# EAGLE schematic rom (EAGLE 9.0.0)

## Sheet 1 of 2
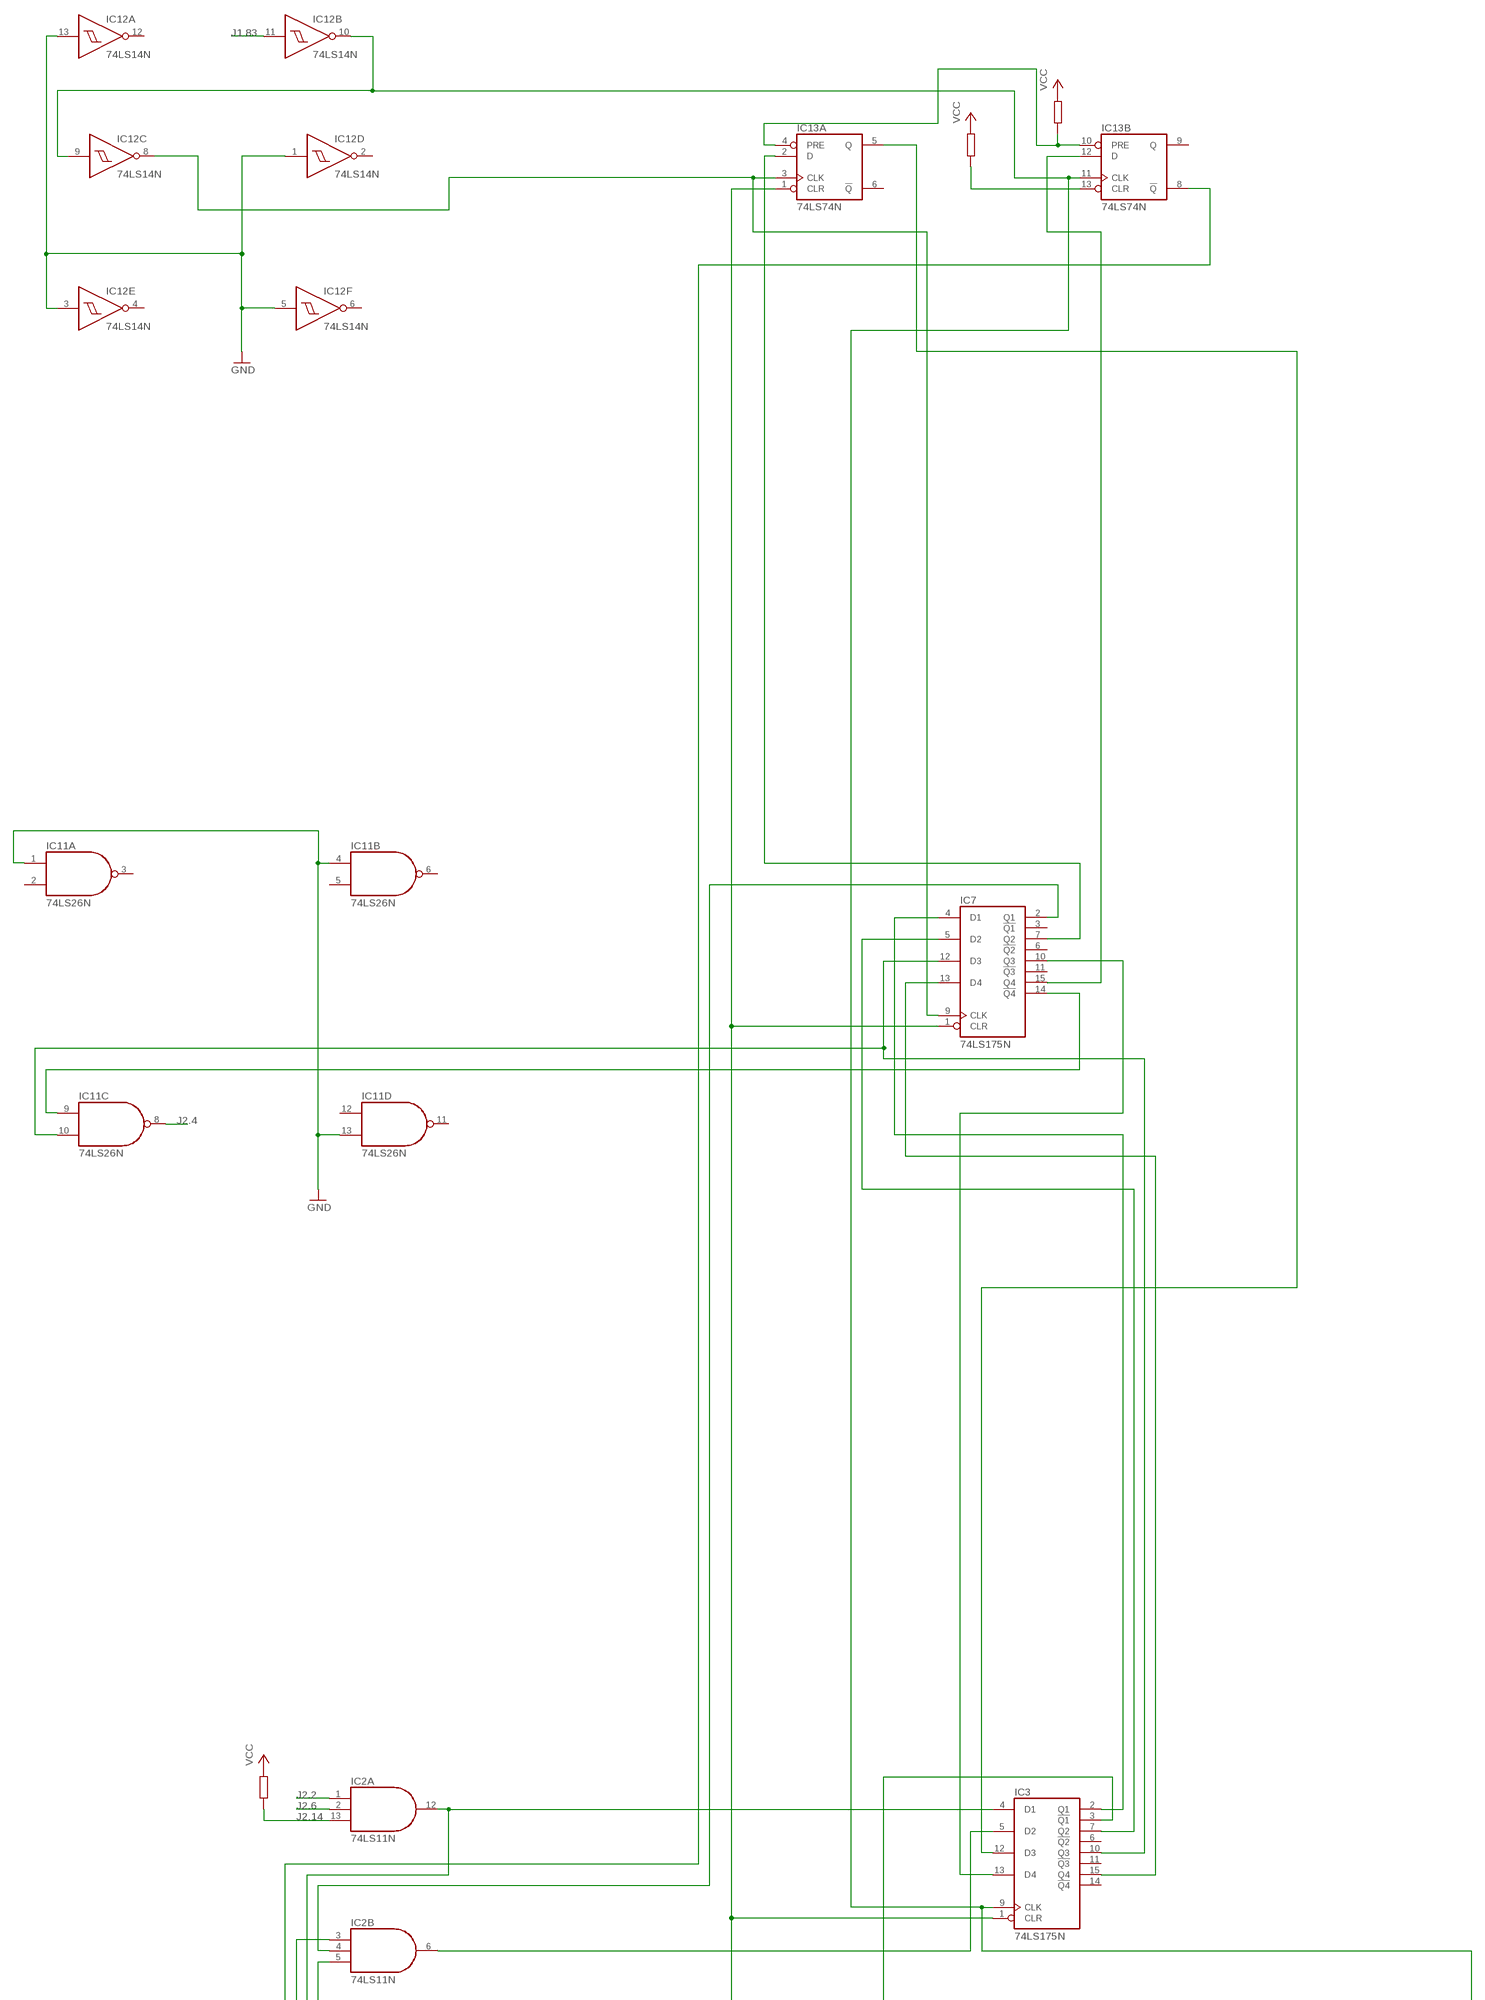
[diagram p0: schematic, sheet 1, part 1 of 3]
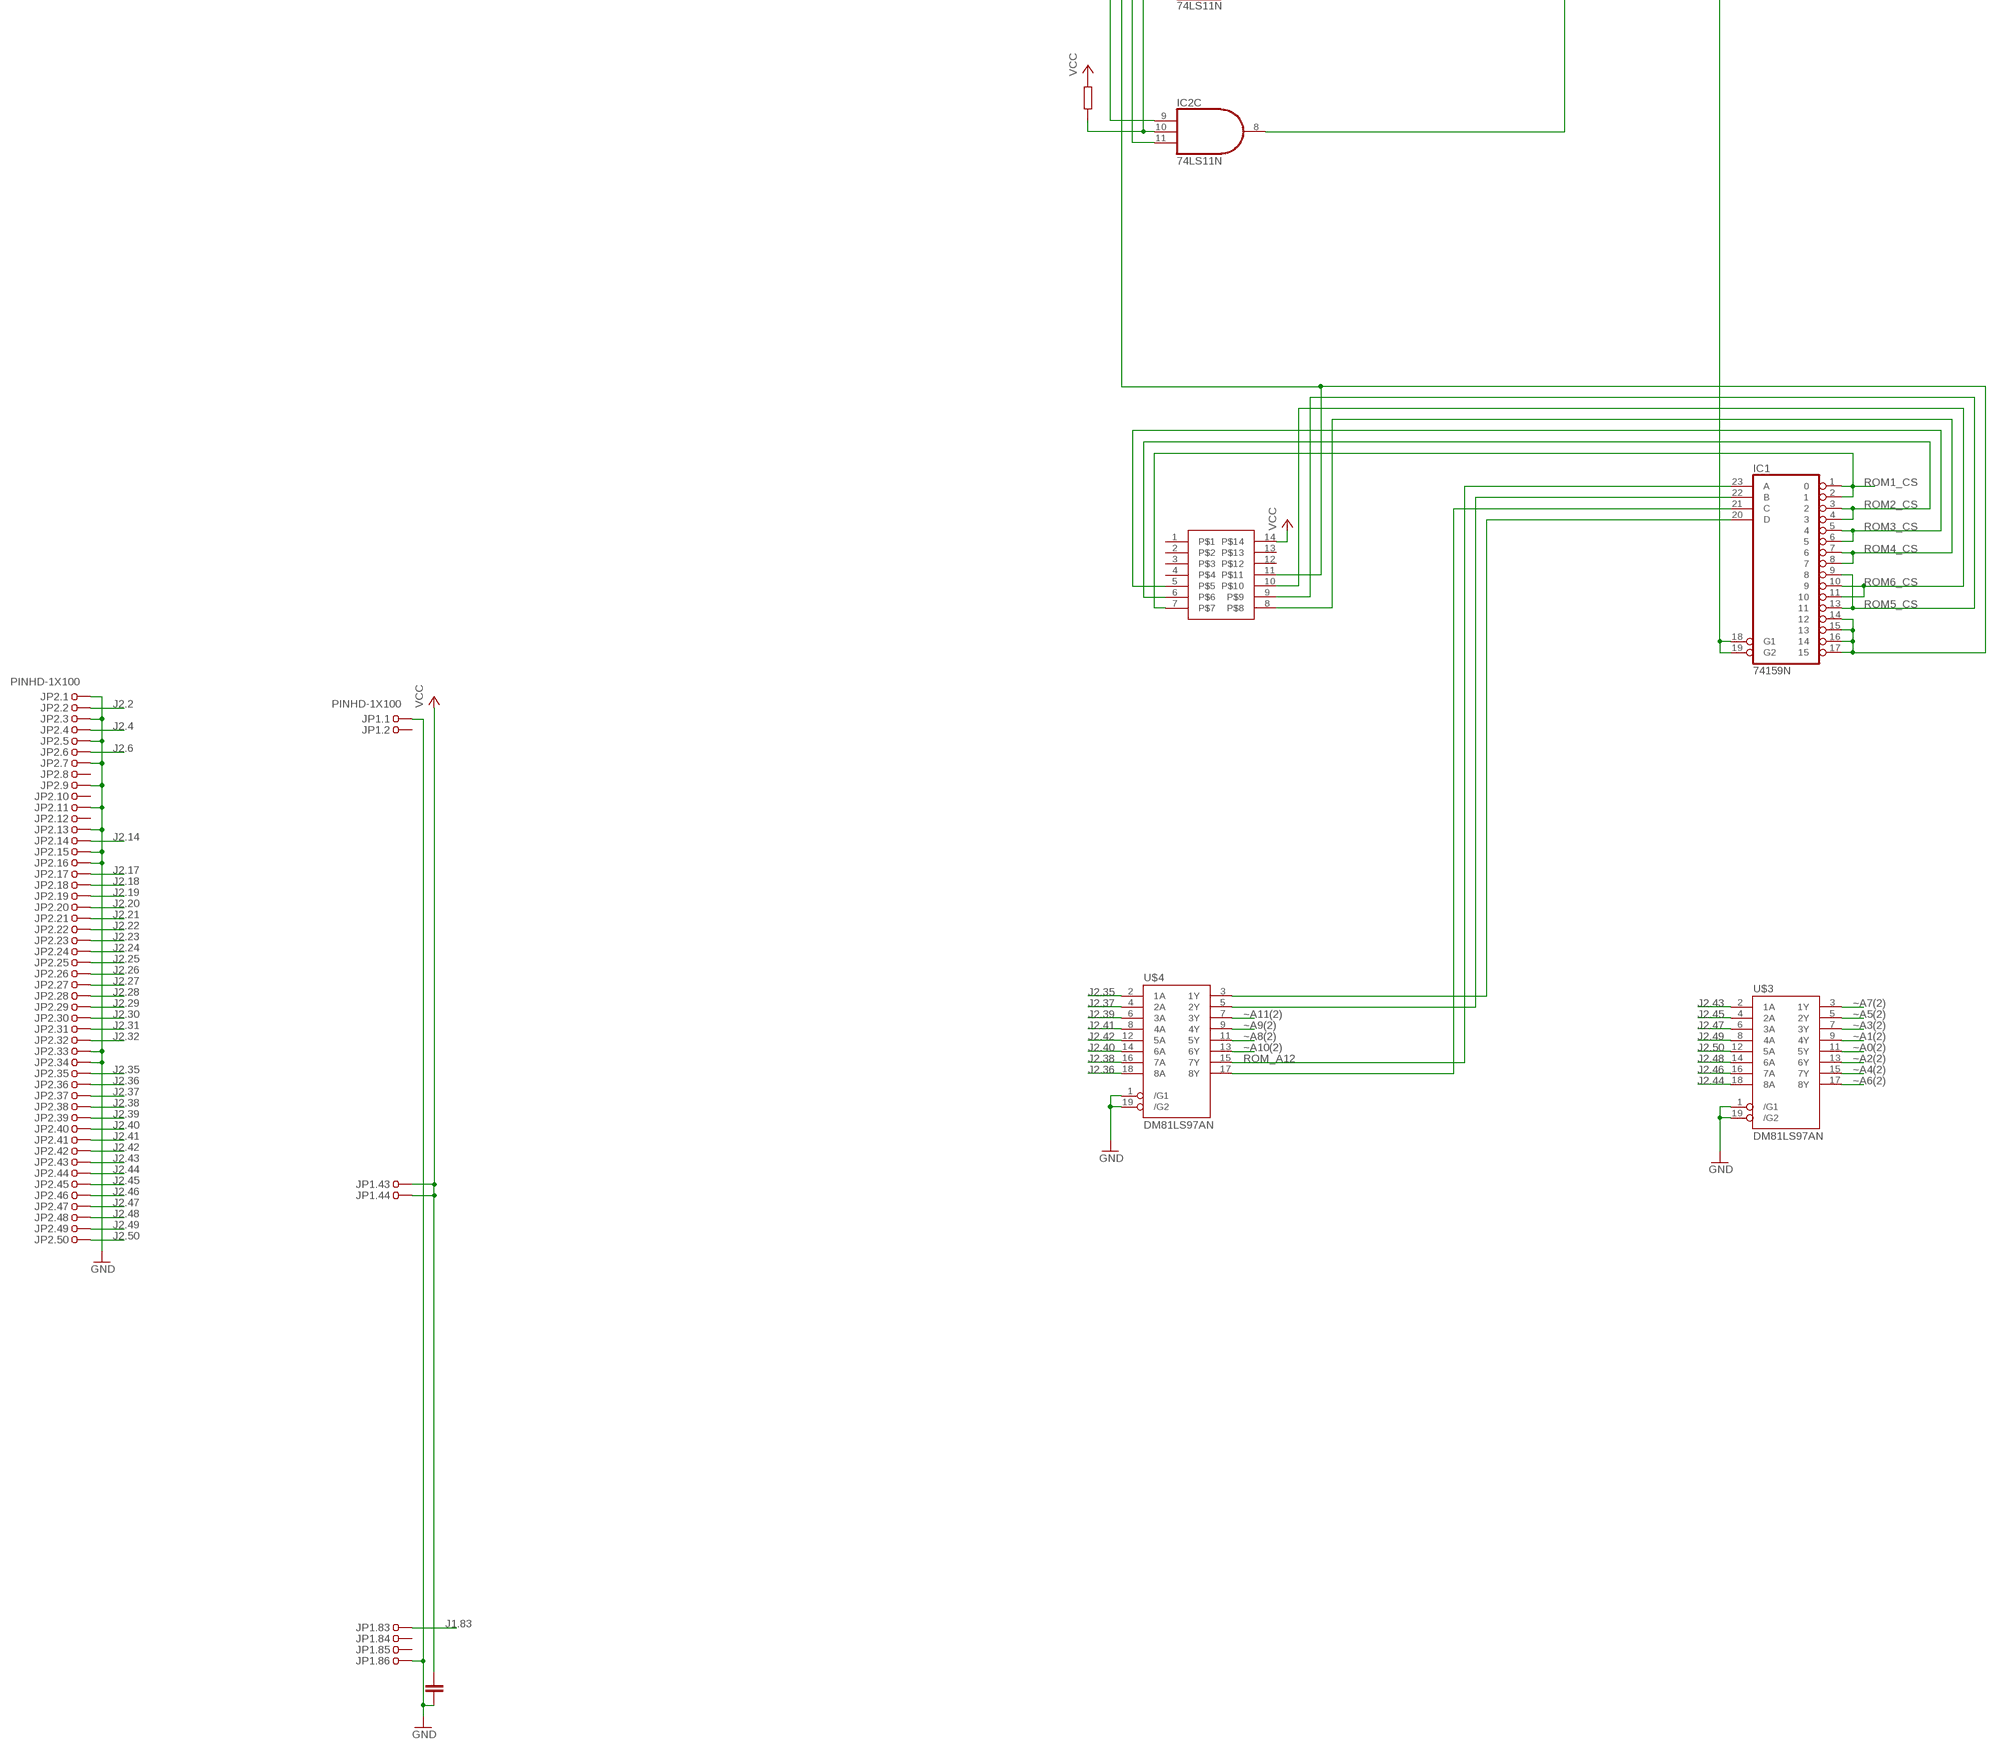
[diagram p1: schematic, sheet 1, part 2 of 3]
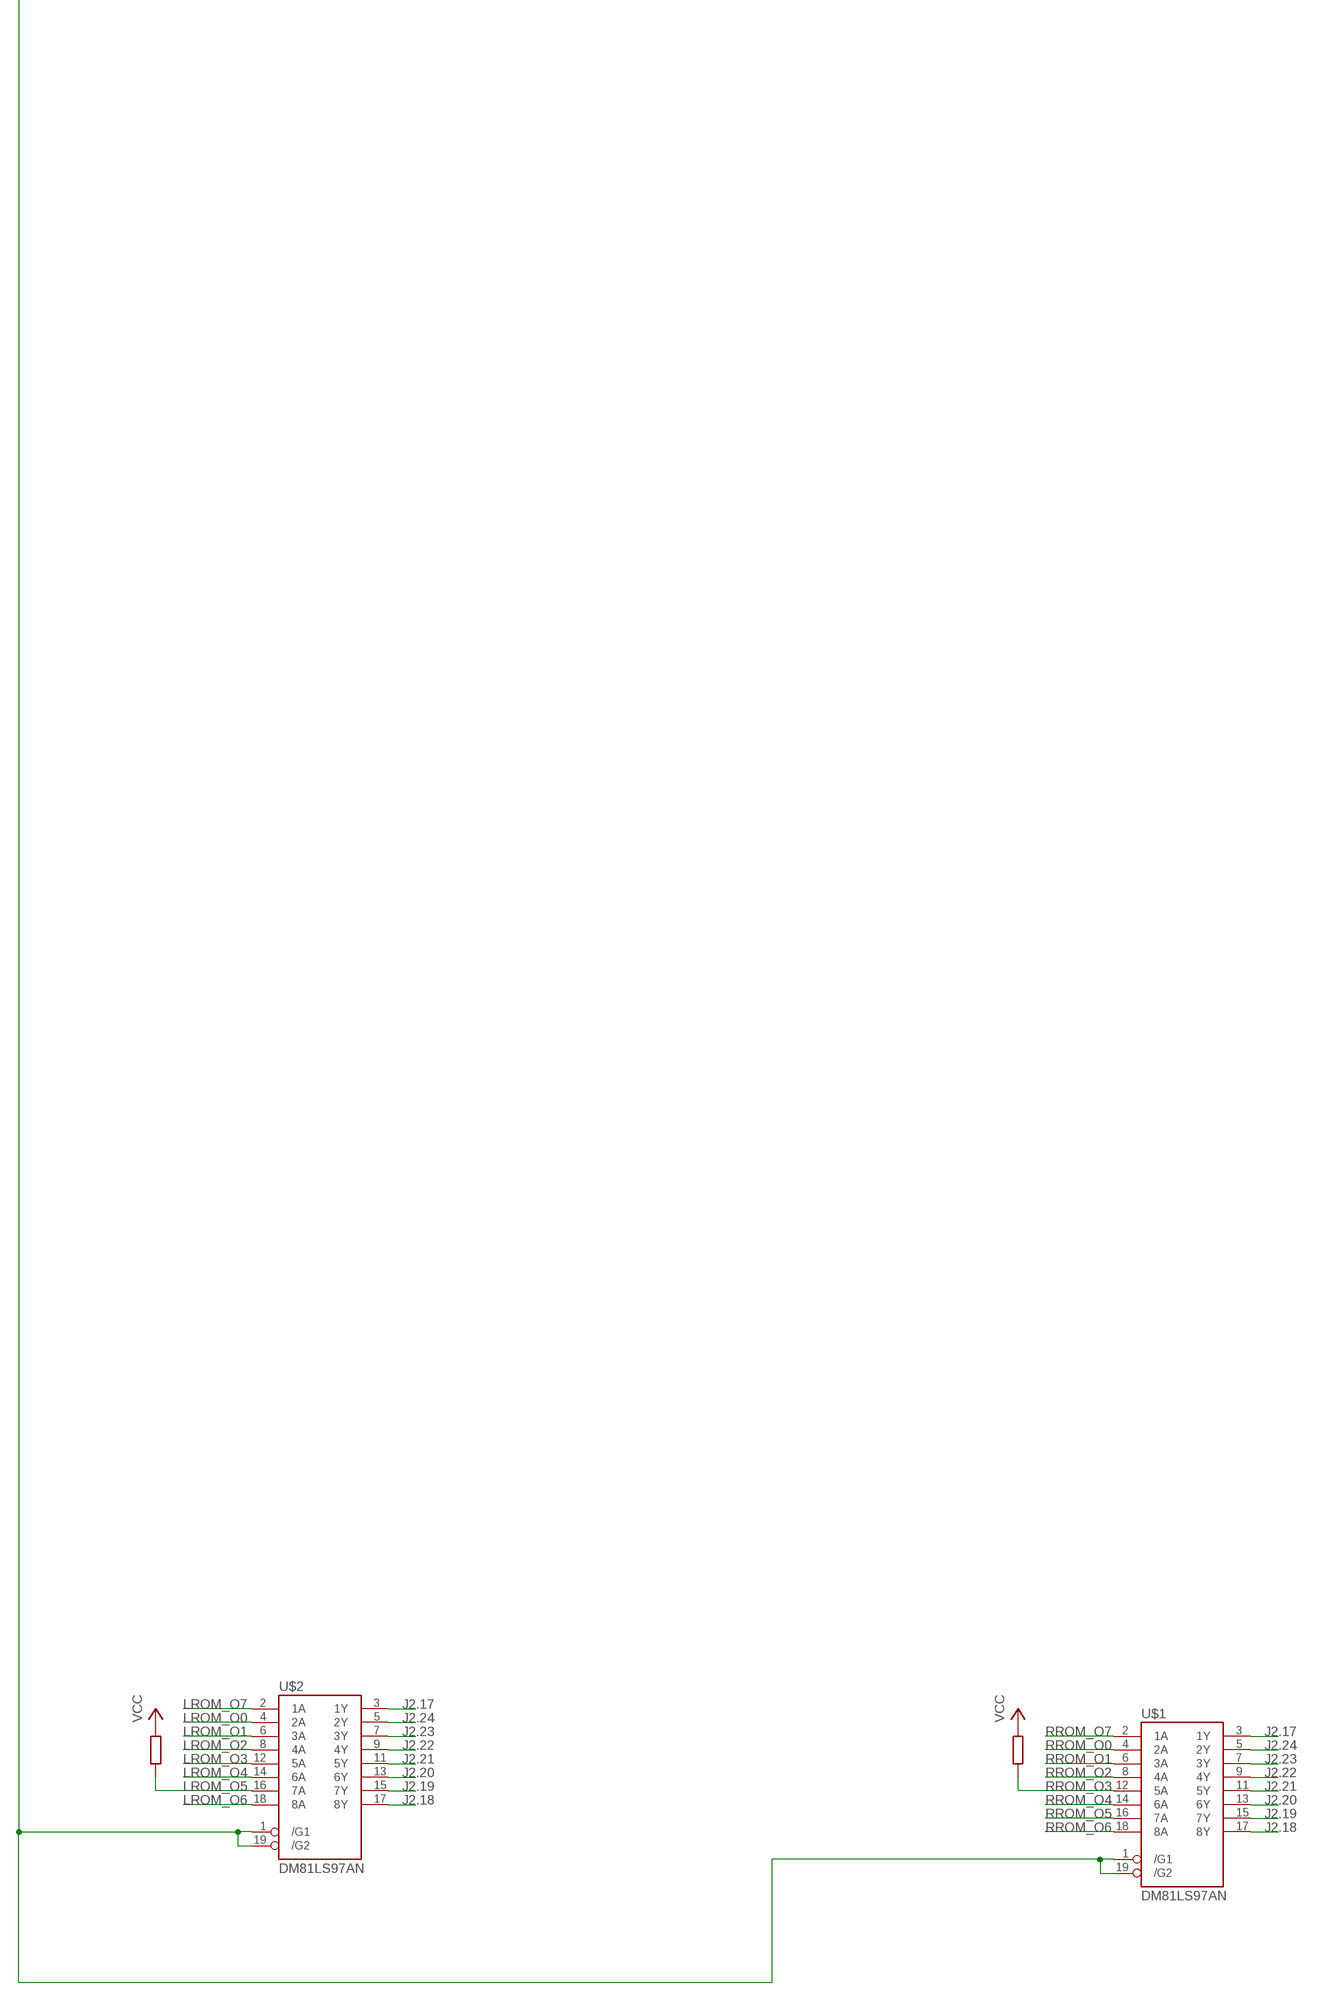
[diagram p2: schematic, sheet 1, part 3 of 3]

### Parts
IC1  74159N  [DIL24-6]
IC2  74LS11N  [DIL14]
IC3  74LS175N  [DIL16]
IC7  74LS175N  [DIL16]
IC11  74LS26N  [DIL14]
IC12  74LS14N  [DIL14]
IC13  74LS74N  [DIL14]
JP1  PINHD-1X100  [1X100]
JP2  PINHD-1X100  [1X100]
U$1  DM81LS97AN  [DIL20]
U$2  DM81LS97AN  [DIL20]
U$3  DM81LS97AN  [DIL20]
U$4  DM81LS97AN  [DIL20]
U$5  1810-0083  [DIL14]

### Nets
GND: IC11.1(A:I0) IC11.4(B:I0) IC11.13(D:I1) IC12.1(D:I) IC12.3(E:I) IC12.5(F:I) IC12.13(A:I) JP1.1 JP1.86 JP2.1 JP2.3 JP2.5 JP2.7 JP2.9 JP2.11 JP2.13 JP2.15 JP2.16 JP2.33 JP2.34 U$3.1(/G1) U$3.19(/G2) U$4.1(/G1) U$4.19(/G2) ; also sheet 2
J1.83: IC12.11(B:I) JP1.83
J2.2: IC2.1(A:I0) JP2.2
J2.4: JP2.4
J2.6: IC2.2(A:I1) JP2.6
J2.14: IC2.13(A:I2) JP2.14 ; also sheet 2
J2.17: JP2.17 U$1.3(1Y) U$2.3(1Y)
J2.18: JP2.18 U$1.17(8Y) U$2.17(8Y)
J2.19: JP2.19 U$1.15(7Y) U$2.15(7Y)
J2.20: JP2.20 U$1.13(6Y) U$2.13(6Y)
J2.21: JP2.21 U$1.11(5Y) U$2.11(5Y)
J2.22: JP2.22 U$1.9(4Y) U$2.9(4Y)
J2.23: JP2.23 U$1.7(3Y) U$2.7(3Y)
J2.24: JP2.24 U$1.5(2Y) U$2.5(2Y)
J2.25: JP2.25
J2.26: JP2.26
J2.27: JP2.27
J2.28: JP2.28
J2.29: JP2.29
J2.30: JP2.30
J2.31: JP2.31
J2.32: JP2.32
J2.35: JP2.35 U$4.2(1A)
J2.36: JP2.36 U$4.18(8A)
J2.37: JP2.37 U$4.4(2A)
J2.38: JP2.38 U$4.16(7A)
J2.39: JP2.39 U$4.6(3A)
J2.40: JP2.40 U$4.14(6A)
J2.41: JP2.41 U$4.8(4A)
J2.42: JP2.42 U$4.12(5A)
J2.43: JP2.43 U$3.2(1A)
J2.44: JP2.44 U$3.18(8A)
J2.45: JP2.45 U$3.4(2A)
J2.46: JP2.46 U$3.16(7A)
J2.47: JP2.47 U$3.6(3A)
J2.48: JP2.48 U$3.14(6A)
J2.49: JP2.49 U$3.8(4A)
J2.50: JP2.50 U$3.12(5A)
LROM_O0: U$2.4(2A) ; also sheet 2
LROM_O1: U$2.6(3A) ; also sheet 2
LROM_O2: U$2.8(4A) ; also sheet 2
LROM_O3: U$2.12(5A) ; also sheet 2
LROM_O4: U$2.14(6A) ; also sheet 2
LROM_O5: U$2.16(7A) ; also sheet 2
LROM_O6: U$2.18(8A) ; also sheet 2
LROM_O7: U$2.2(1A) ; also sheet 2
N$1: IC1.20(D) U$4.3(1Y)
N$2: IC1.22(B) U$4.5(2Y)
N$3: IC7.7(Q2) IC13.2(A:D)
N$4: IC2.8(C:O) IC3.1(CLR) IC7.1(CLR) IC13.1(A:CLR)
N$5: IC2.4(B:I1) IC7.2(Q1)
N$6: IC2.6(B:O) IC3.5(D2)
N$7: IC2.9(C:I0) IC13.8(B:!Q)
N$8: IC3.12(D3) IC13.5(A:Q)
N$9: IC3.13(D4) IC7.10(Q3)
N$10: IC3.15(Q4) IC7.13(D4)
N$11: IC1.14 IC1.15 IC1.16 IC1.17 IC2.3(B:I0) U$5.11
N$12: IC1.18(G1) IC1.19(G2) IC3.3(!Q1)
N$13: IC2.5(B:I2) IC2.10(C:I1)
N$14: IC2.11(C:I2) IC2.12(A:O) IC3.4(D1)
N$15: IC1.21(C) U$4.17(8Y)
N$16: IC3.2(Q1) IC7.4(D1)
N$17: IC3.9(CLK) IC12.9(C:I) IC12.10(B:O) IC13.11(B:CLK) U$1.1(/G1) U$1.19(/G2) U$2.1(/G1) U$2.19(/G2)
N$18: IC3.7(Q2) IC7.5(D2)
N$19: IC3.10(Q3) IC7.12(D3) IC11.10(C:I1)
N$20: IC7.14(!Q4) IC11.9(C:I0)
N$21: IC13.4(A:PRE) IC13.10(B:PRE)
N$22: IC7.15(Q4) IC13.12(B:D)
N$23: IC7.9(CLK) IC12.8(C:O) IC13.3(A:CLK)
N$24: IC13.13(B:CLR)
ROM1_CS: IC1.1 IC1.2 U$5.7 ; also sheet 2
ROM2_CS: IC1.3 IC1.4 U$5.6 ; also sheet 2
ROM3_CS: IC1.5 IC1.6 U$5.5 ; also sheet 2
ROM4_CS: IC1.7 IC1.8 U$5.8 ; also sheet 2
ROM5_CS: IC1.9 IC1.13 U$5.9 ; also sheet 2
ROM6_CS: IC1.10 IC1.11 U$5.10 ; also sheet 2
ROM_A12: IC1.23(A) U$4.15(7Y)
RROM_O0: U$1.4(2A) ; also sheet 2
RROM_O1: U$1.6(3A) ; also sheet 2
RROM_O2: U$1.8(4A) ; also sheet 2
RROM_O3: U$1.12(5A) ; also sheet 2
RROM_O4: U$1.14(6A) ; also sheet 2
RROM_O5: U$1.16(7A) ; also sheet 2
RROM_O6: U$1.18(8A) ; also sheet 2
RROM_O7: U$1.2(1A) ; also sheet 2
VCC: JP1.43 JP1.44 U$5.14 ; also sheet 2
~A0(2): U$3.11(5Y) ; also sheet 2
~A1(2): U$3.9(4Y) ; also sheet 2
~A2(2): U$3.13(6Y) ; also sheet 2
~A3(2): U$3.7(3Y) ; also sheet 2
~A4(2): U$3.15(7Y) ; also sheet 2
~A5(2): U$3.5(2Y) ; also sheet 2
~A6(2): U$3.17(8Y) ; also sheet 2
~A7(2): U$3.3(1Y) ; also sheet 2
~A8(2): U$4.11(5Y) ; also sheet 2
~A9(2): U$4.9(4Y) ; also sheet 2
~A10(2): U$4.13(6Y) ; also sheet 2
~A11(2): U$4.7(3Y) ; also sheet 2
Unconnected: IC3.6(!Q2) IC3.11(!Q3) IC3.14(!Q4) IC7.3(!Q1) IC7.6(!Q2) IC7.11(!Q3) IC11.2(A:I1) IC11.3(A:O) IC11.5(B:I1) IC11.6(B:O) IC11.8(C:O) IC11.11(D:O) IC11.12(D:I0) IC12.2(D:O) IC12.4(E:O) IC12.6(F:O) IC12.12(A:O) IC13.6(A:!Q) IC13.9(B:Q) JP1.2 JP1.3 JP1.4 JP1.5 JP1.6 JP1.7 JP1.8 JP1.9 JP1.10 JP1.11 JP1.12 JP1.13 JP1.14 JP1.15 JP1.16 JP1.17 JP1.18 JP1.19 JP1.20 JP1.21 JP1.22 JP1.23 JP1.24 JP1.25 JP1.26 JP1.27 JP1.28 JP1.29 JP1.30 JP1.31 JP1.32 JP1.33 JP1.34 JP1.35 JP1.36 JP1.37 JP1.38 JP1.39 JP1.40 JP1.41 JP1.42 JP1.45 JP1.46 JP1.47 JP1.48 JP1.49 JP1.50 JP1.51 JP1.52 JP1.53 JP1.54 JP1.55 JP1.56 JP1.57 JP1.58 JP1.59 JP1.60 JP1.61 JP1.62 JP1.63 JP1.64 JP1.65 JP1.66 JP1.67 JP1.68 JP1.69 JP1.70 JP1.71 JP1.72 JP1.73 JP1.74 JP1.75 JP1.76 JP1.77 JP1.78 JP1.79 JP1.80 JP1.81 JP1.82 JP1.84 JP1.85 JP1.87 JP1.88 JP1.89 JP1.90 JP1.91 JP1.92 JP1.93 JP1.94 JP1.95 JP1.96 JP1.97 JP1.98 JP1.99 JP1.100 JP2.8 JP2.10 JP2.12 JP2.51 JP2.52 JP2.53 JP2.54 JP2.55 JP2.56 JP2.57 JP2.58 JP2.59 JP2.60 JP2.61 JP2.62 JP2.63 JP2.64 JP2.65 JP2.66 JP2.67 JP2.68 JP2.69 JP2.70 JP2.71 JP2.72 JP2.73 JP2.74 JP2.75 JP2.76 JP2.77 JP2.78 JP2.79 JP2.80 JP2.81 JP2.82 JP2.83 JP2.84 JP2.85 JP2.86 JP2.87 JP2.88 JP2.89 JP2.90 JP2.91 JP2.92 JP2.93 JP2.94 JP2.95 JP2.96 JP2.97 JP2.98 JP2.99 JP2.100 U$5.1 U$5.2 U$5.3 U$5.4 U$5.12 U$5.13

## Sheet 2 of 2
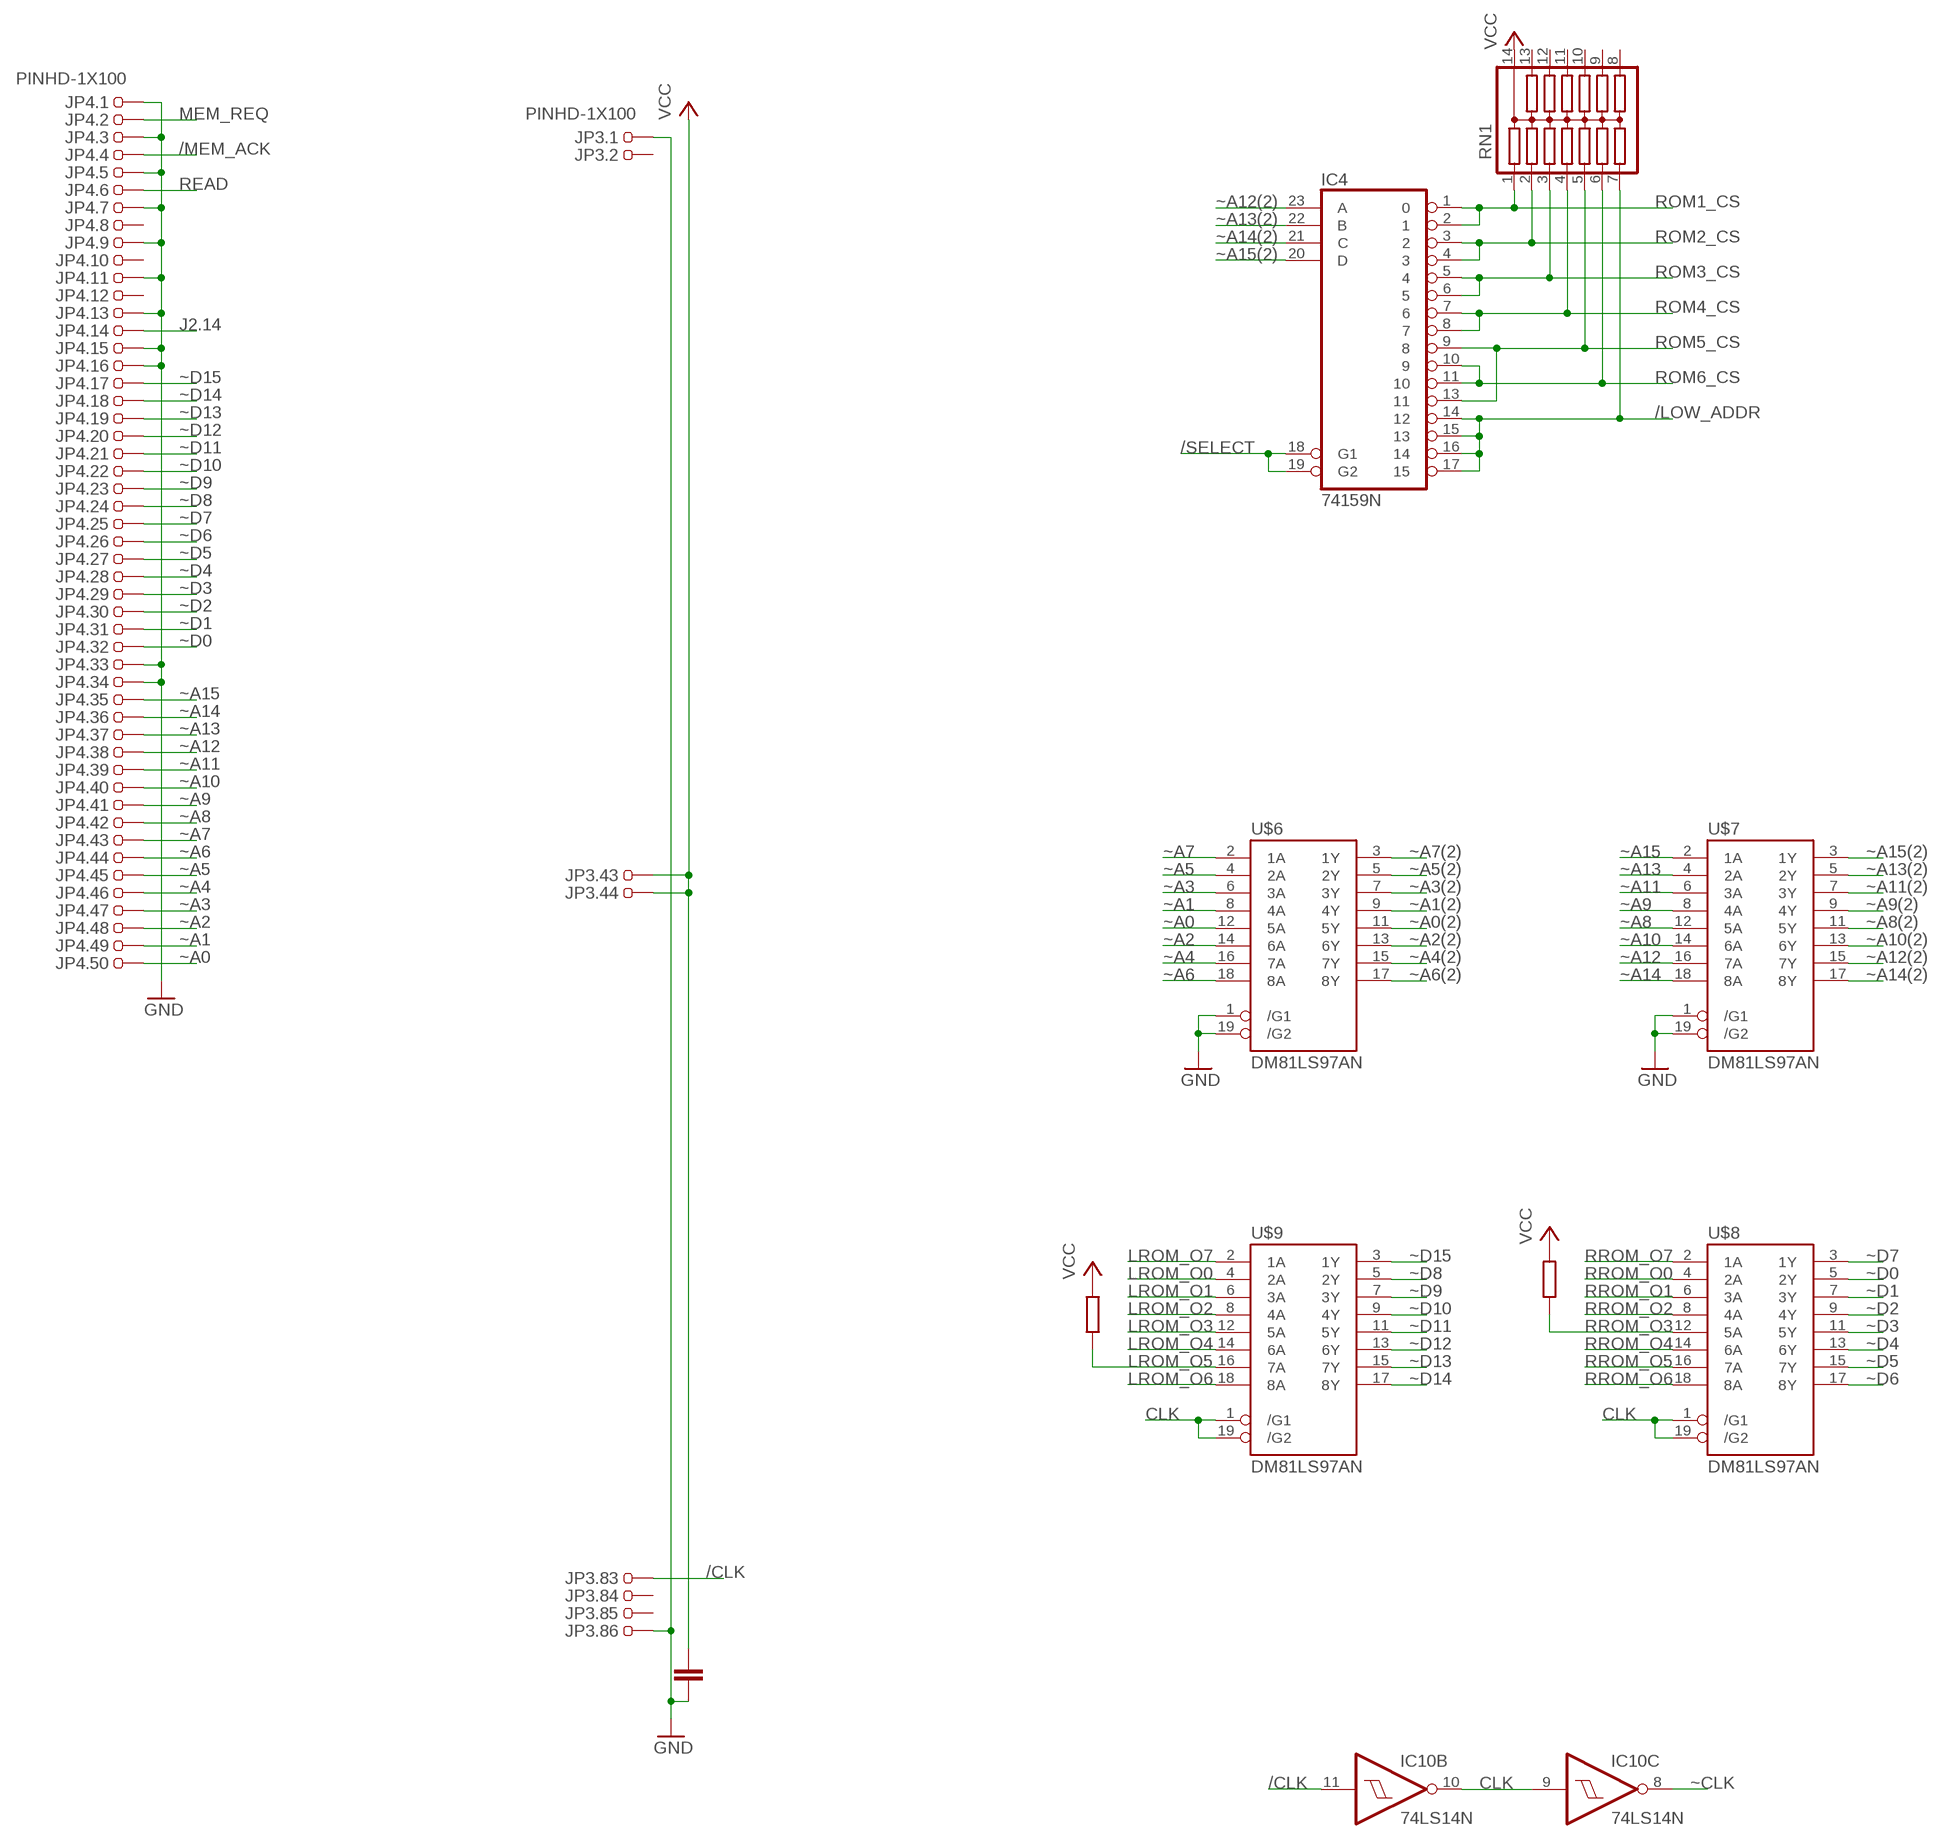
[diagram p3: schematic, sheet 2, part 1 of 2]
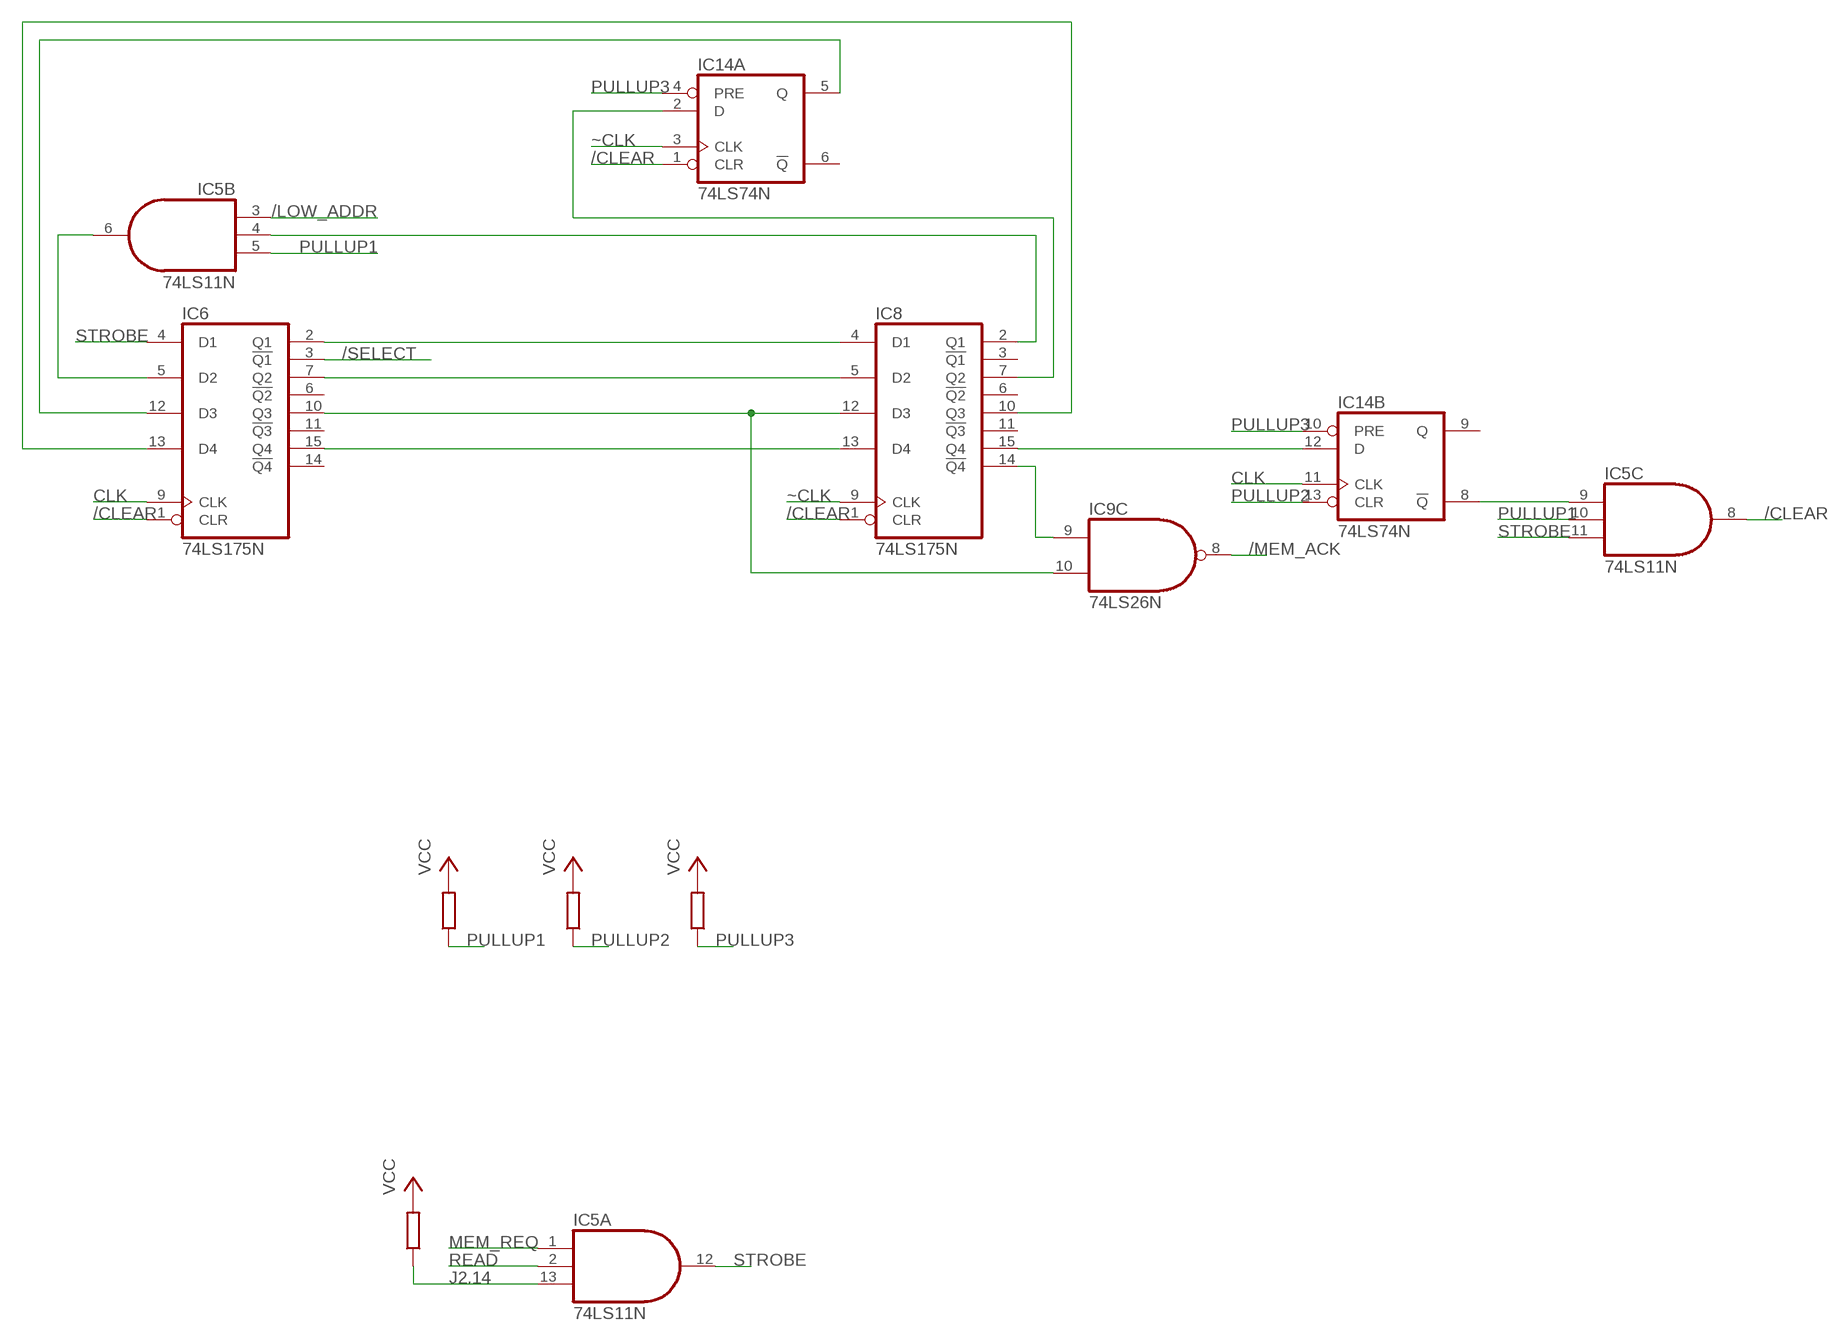
[diagram p4: schematic, sheet 2, part 2 of 2]

### Parts
IC4  74159N  [DIL24-6]
IC5  74LS11N  [DIL14]
IC6  74LS175N  [DIL16]
IC8  74LS175N  [DIL16]
IC9  74LS26N  [DIL14]
IC10  74LS14N  [DIL14]
IC14  74LS74N  [DIL14]
JP3  PINHD-1X100  [1X100]
JP4  PINHD-1X100  [1X100]
RN1  13R  [DIL14]
U$6  DM81LS97AN  [DIL20]
U$7  DM81LS97AN  [DIL20]
U$8  DM81LS97AN  [DIL20]
U$9  DM81LS97AN  [DIL20]

### Nets
/CLEAR: IC5.8(C:O) IC6.1(CLR) IC8.1(CLR) IC14.1(A:CLR)
/CLK: IC10.11(B:I) JP3.83
/LOW_ADDR: IC4.14 IC4.15 IC4.16 IC4.17 IC5.3(B:I0) RN1.7
/MEM_ACK: IC9.8(C:O) JP4.4
/SELECT: IC4.18(G1) IC4.19(G2) IC6.3(!Q1)
CLK: IC6.9(CLK) IC10.10(B:O) IC14.11(B:CLK) U$8.1(/G1) U$8.19(/G2) U$9.1(/G1) U$9.19(/G2)
GND: JP3.1 JP3.86 JP4.1 JP4.3 JP4.5 JP4.7 JP4.9 JP4.11 JP4.13 JP4.15 JP4.16 JP4.33 JP4.34 U$6.1(/G1) U$6.19(/G2) U$7.1(/G1) U$7.19(/G2) ; also sheet 1
J2.14: IC5.13(A:I2) JP4.14 ; also sheet 1
LROM_O0: U$9.4(2A) ; also sheet 1
LROM_O1: U$9.6(3A) ; also sheet 1
LROM_O2: U$9.8(4A) ; also sheet 1
LROM_O3: U$9.12(5A) ; also sheet 1
LROM_O4: U$9.14(6A) ; also sheet 1
LROM_O5: U$9.16(7A) ; also sheet 1
LROM_O6: U$9.18(8A) ; also sheet 1
LROM_O7: U$9.2(1A) ; also sheet 1
MEM_REQ: IC5.1(A:I0) JP4.2
N$26: IC10.9(C:I)
N$27: IC6.12(D3) IC14.5(A:Q)
N$34: IC5.4(B:I1) IC8.2(Q1)
N$35: IC5.6(B:O) IC6.5(D2)
N$37: IC5.9(C:I0) IC14.8(B:!Q)
N$39: IC6.13(D4) IC8.10(Q3)
N$40: IC6.15(Q4) IC8.13(D4)
N$41: IC6.2(Q1) IC8.4(D1)
N$42: IC6.7(Q2) IC8.5(D2)
N$43: IC6.10(Q3) IC8.12(D3) IC9.10(C:I1)
N$44: IC8.14(!Q4) IC9.9(C:I0)
N$45: IC8.15(Q4) IC14.12(B:D)
N$47: IC8.7(Q2) IC14.2(A:D)
PULLUP1: IC5.5(B:I2) IC5.10(C:I1)
PULLUP2: IC14.13(B:CLR)
PULLUP3: IC14.4(A:PRE) IC14.10(B:PRE)
READ: IC5.2(A:I1) JP4.6
ROM1_CS: IC4.1 IC4.2 RN1.1 ; also sheet 1
ROM2_CS: IC4.3 IC4.4 RN1.2 ; also sheet 1
ROM3_CS: IC4.5 IC4.6 RN1.3 ; also sheet 1
ROM4_CS: IC4.7 IC4.8 RN1.4 ; also sheet 1
ROM5_CS: IC4.9 IC4.13 RN1.5 ; also sheet 1
ROM6_CS: IC4.10 IC4.11 RN1.6 ; also sheet 1
RROM_O0: U$8.4(2A) ; also sheet 1
RROM_O1: U$8.6(3A) ; also sheet 1
RROM_O2: U$8.8(4A) ; also sheet 1
RROM_O3: U$8.12(5A) ; also sheet 1
RROM_O4: U$8.14(6A) ; also sheet 1
RROM_O5: U$8.16(7A) ; also sheet 1
RROM_O6: U$8.18(8A) ; also sheet 1
RROM_O7: U$8.2(1A) ; also sheet 1
STROBE: IC5.11(C:I2) IC5.12(A:O) IC6.4(D1)
VCC: JP3.43 JP3.44 RN1.14 ; also sheet 1
~A0: JP4.50 U$6.12(5A)
~A0(2): U$6.11(5Y) ; also sheet 1
~A1: JP4.49 U$6.8(4A)
~A1(2): U$6.9(4Y) ; also sheet 1
~A2: JP4.48 U$6.14(6A)
~A2(2): U$6.13(6Y) ; also sheet 1
~A3: JP4.47 U$6.6(3A)
~A3(2): U$6.7(3Y) ; also sheet 1
~A4: JP4.46 U$6.16(7A)
~A4(2): U$6.15(7Y) ; also sheet 1
~A5: JP4.45 U$6.4(2A)
~A5(2): U$6.5(2Y) ; also sheet 1
~A6: JP4.44 U$6.18(8A)
~A6(2): U$6.17(8Y) ; also sheet 1
~A7: JP4.43 U$6.2(1A)
~A7(2): U$6.3(1Y) ; also sheet 1
~A8: JP4.42 U$7.12(5A)
~A8(2): U$7.11(5Y) ; also sheet 1
~A9: JP4.41 U$7.8(4A)
~A9(2): U$7.9(4Y) ; also sheet 1
~A10: JP4.40 U$7.14(6A)
~A10(2): U$7.13(6Y) ; also sheet 1
~A11: JP4.39 U$7.6(3A)
~A11(2): U$7.7(3Y) ; also sheet 1
~A12: JP4.38 U$7.16(7A)
~A12(2): IC4.23(A) U$7.15(7Y)
~A13: JP4.37 U$7.4(2A)
~A13(2): IC4.22(B) U$7.5(2Y)
~A14: JP4.36 U$7.18(8A)
~A14(2): IC4.21(C) U$7.17(8Y)
~A15: JP4.35 U$7.2(1A)
~A15(2): IC4.20(D) U$7.3(1Y)
~CLK: IC8.9(CLK) IC10.8(C:O) IC14.3(A:CLK)
~D0: JP4.32 U$8.5(2Y)
~D1: JP4.31 U$8.7(3Y)
~D2: JP4.30 U$8.9(4Y)
~D3: JP4.29 U$8.11(5Y)
~D4: JP4.28 U$8.13(6Y)
~D5: JP4.27 U$8.15(7Y)
~D6: JP4.26 U$8.17(8Y)
~D7: JP4.25 U$8.3(1Y)
~D8: JP4.24 U$9.5(2Y)
~D9: JP4.23 U$9.7(3Y)
~D10: JP4.22 U$9.9(4Y)
~D11: JP4.21 U$9.11(5Y)
~D12: JP4.20 U$9.13(6Y)
~D13: JP4.19 U$9.15(7Y)
~D14: JP4.18 U$9.17(8Y)
~D15: JP4.17 U$9.3(1Y)
Unconnected: IC6.6(!Q2) IC6.11(!Q3) IC6.14(!Q4) IC8.3(!Q1) IC8.6(!Q2) IC8.11(!Q3) IC9.1(A:I0) IC9.2(A:I1) IC9.3(A:O) IC9.4(B:I0) IC9.5(B:I1) IC9.6(B:O) IC9.11(D:O) IC9.12(D:I0) IC9.13(D:I1) IC10.1(D:I) IC10.2(D:O) IC10.3(E:I) IC10.4(E:O) IC10.5(F:I) IC10.6(F:O) IC10.12(A:O) IC10.13(A:I) IC14.6(A:!Q) IC14.9(B:Q) JP3.2 JP3.3 JP3.4 JP3.5 JP3.6 JP3.7 JP3.8 JP3.9 JP3.10 JP3.11 JP3.12 JP3.13 JP3.14 JP3.15 JP3.16 JP3.17 JP3.18 JP3.19 JP3.20 JP3.21 JP3.22 JP3.23 JP3.24 JP3.25 JP3.26 JP3.27 JP3.28 JP3.29 JP3.30 JP3.31 JP3.32 JP3.33 JP3.34 JP3.35 JP3.36 JP3.37 JP3.38 JP3.39 JP3.40 JP3.41 JP3.42 JP3.45 JP3.46 JP3.47 JP3.48 JP3.49 JP3.50 JP3.51 JP3.52 JP3.53 JP3.54 JP3.55 JP3.56 JP3.57 JP3.58 JP3.59 JP3.60 JP3.61 JP3.62 JP3.63 JP3.64 JP3.65 JP3.66 JP3.67 JP3.68 JP3.69 JP3.70 JP3.71 JP3.72 JP3.73 JP3.74 JP3.75 JP3.76 JP3.77 JP3.78 JP3.79 JP3.80 JP3.81 JP3.82 JP3.84 JP3.85 JP3.87 JP3.88 JP3.89 JP3.90 JP3.91 JP3.92 JP3.93 JP3.94 JP3.95 JP3.96 JP3.97 JP3.98 JP3.99 JP3.100 JP4.8 JP4.10 JP4.12 JP4.51 JP4.52 JP4.53 JP4.54 JP4.55 JP4.56 JP4.57 JP4.58 JP4.59 JP4.60 JP4.61 JP4.62 JP4.63 JP4.64 JP4.65 JP4.66 JP4.67 JP4.68 JP4.69 JP4.70 JP4.71 JP4.72 JP4.73 JP4.74 JP4.75 JP4.76 JP4.77 JP4.78 JP4.79 JP4.80 JP4.81 JP4.82 JP4.83 JP4.84 JP4.85 JP4.86 JP4.87 JP4.88 JP4.89 JP4.90 JP4.91 JP4.92 JP4.93 JP4.94 JP4.95 JP4.96 JP4.97 JP4.98 JP4.99 JP4.100 RN1.8 RN1.9 RN1.10 RN1.11 RN1.12 RN1.13

## Power pins joined to a net without a drawn wire
GND: IC1.12(GND) IC2.7(P:GND) IC3.8(GND) IC4.12(GND) IC5.7(P:GND) IC6.8(GND) IC7.8(GND) IC8.8(GND) IC9.7(P:GND) IC10.7(P:GND) IC11.7(P:GND) IC12.7(P:GND) IC13.7(P:GND) IC14.7(P:GND)
VCC: IC1.24(VCC) IC2.14(P:VCC) IC3.16(VCC) IC4.24(VCC) IC5.14(P:VCC) IC6.16(VCC) IC7.16(VCC) IC8.16(VCC) IC9.14(P:VCC) IC10.14(P:VCC) IC11.14(P:VCC) IC12.14(P:VCC) IC13.14(P:VCC) IC14.14(P:VCC)

## Library data of the parts
IC1 IC4 = 74xx-us:74*159: 4-line to 16-line DECODER/DEMULTIPLEXER, open collector
IC2 IC5 = 74xx-us:74*11: Triple 3-input AND gate
IC3 IC6-IC8 = 74xx-us:74*175: Qadruple D type FLIP FLOP, clear
IC9 IC11 = 74xx-us:74*26: Quad 2-input high voltage interface NAND gate
IC10 IC12 = 74xx-us:74*14: Hex schmitt trigger INVERTER
IC13 IC14 = 74xx-us:74*74: Dual D type positive edge triggered FLIP FLOP, preset and clear
JP1-JP4 = pinhead:PINHD-1X100: PIN HEADER 100 pol. Grid 2.54mm
RN1 = resistor-dil:13R: DIL RESISTOR; OC_FARNELL: unknown; OC_NEWARK: unknown
U$1-U$4 U$6-U$9 = User-Submitted:DM81LS97AN
U$5 = User-Submitted:1810-0083